# Altium project SolarArray1.PrjPCB
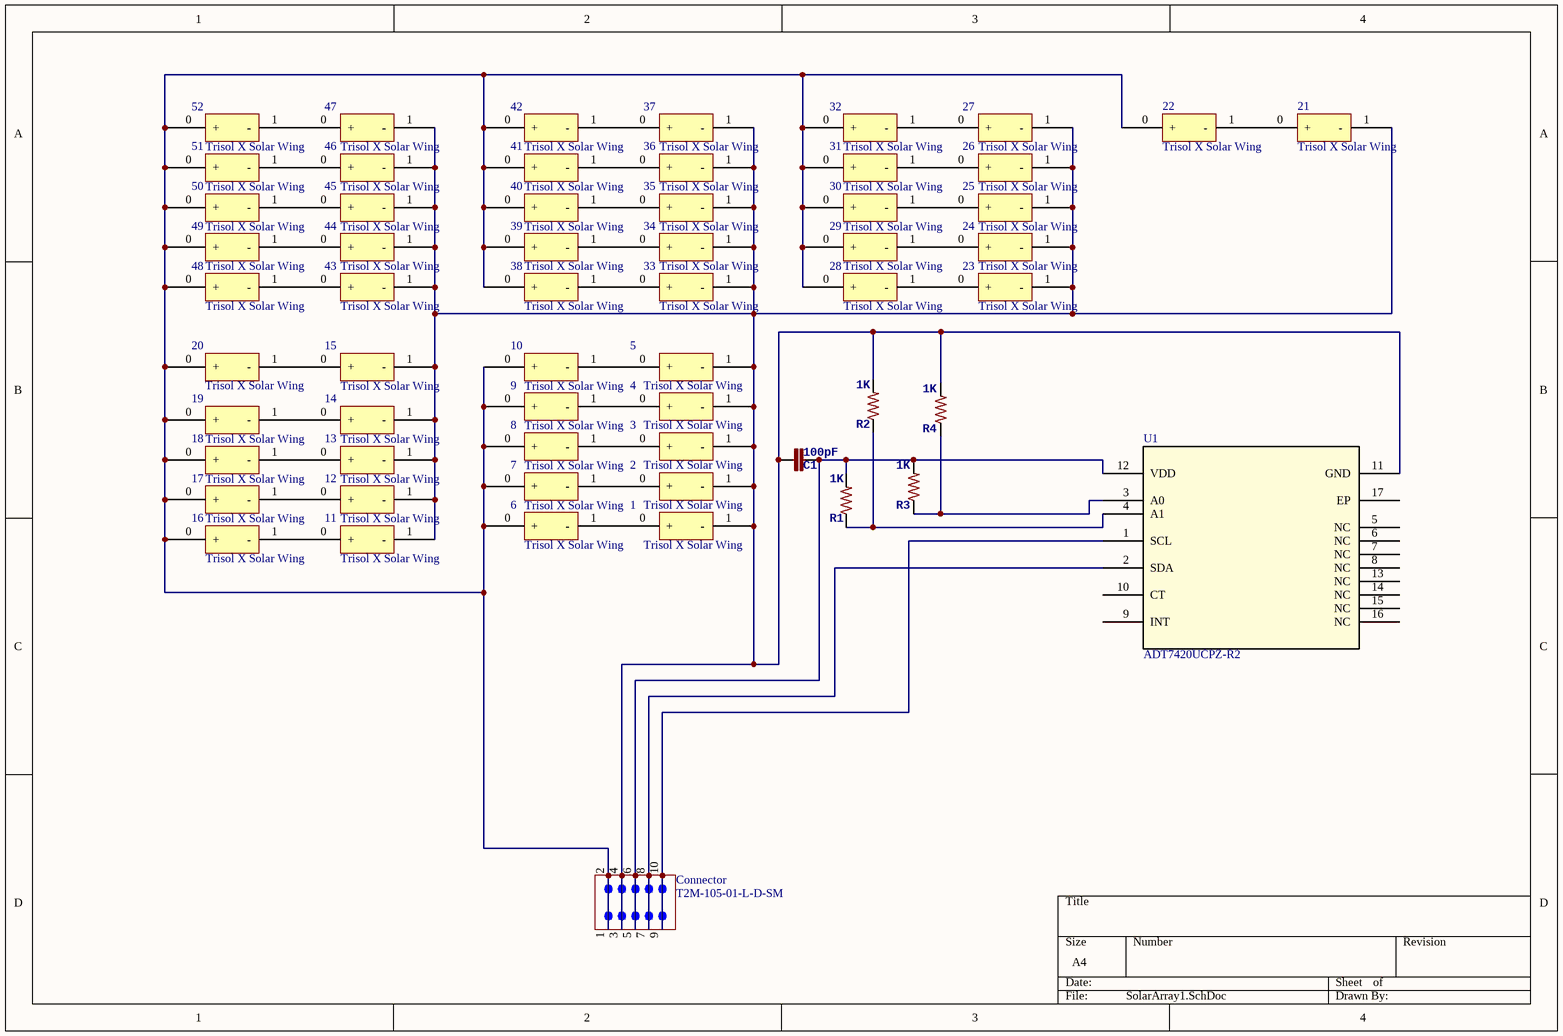
[diagram p0: SolarArray1.SchDoc]
1 sheet, 59 parts. Net scope: global (net labels, ports and power ports of the same name join across sheets).
Board file: SolarArray1.PcbDoc

## Sheet SolarArray1.SchDoc
size A4

### Parts
1  Trisol X Solar Wing  [PCBComponent_1]
2  Trisol X Solar Wing  [PCBComponent_1]
3  Trisol X Solar Wing  [PCBComponent_1]
4  Trisol X Solar Wing  [PCBComponent_1]
5  Trisol X Solar Wing  [PCBComponent_1]
6  Trisol X Solar Wing  [PCBComponent_1]
7  Trisol X Solar Wing  [PCBComponent_1]
8  Trisol X Solar Wing  [PCBComponent_1]
9  Trisol X Solar Wing  [PCBComponent_1]
10  Trisol X Solar Wing  [PCBComponent_1]
11  Trisol X Solar Wing  [PCBComponent_1]
12  Trisol X Solar Wing  [PCBComponent_1]
13  Trisol X Solar Wing  [PCBComponent_1]
14  Trisol X Solar Wing  [PCBComponent_1]
15  Trisol X Solar Wing  [PCBComponent_1]
16  Trisol X Solar Wing  [PCBComponent_1]
17  Trisol X Solar Wing  [PCBComponent_1]
18  Trisol X Solar Wing  [PCBComponent_1]
19  Trisol X Solar Wing  [PCBComponent_1]
20  Trisol X Solar Wing  [PCBComponent_1]
21  Trisol X Solar Wing  [PCBComponent_1]
22  Trisol X Solar Wing  [PCBComponent_1]
23  Trisol X Solar Wing  [PCBComponent_1]
24  Trisol X Solar Wing  [PCBComponent_1]
25  Trisol X Solar Wing  [PCBComponent_1]
26  Trisol X Solar Wing  [PCBComponent_1]
27  Trisol X Solar Wing  [PCBComponent_1]
28  Trisol X Solar Wing  [PCBComponent_1]
29  Trisol X Solar Wing  [PCBComponent_1]
30  Trisol X Solar Wing  [PCBComponent_1]
31  Trisol X Solar Wing  [PCBComponent_1]
32  Trisol X Solar Wing  [PCBComponent_1]
33  Trisol X Solar Wing  [PCBComponent_1]
34  Trisol X Solar Wing  [PCBComponent_1]
35  Trisol X Solar Wing  [PCBComponent_1]
36  Trisol X Solar Wing  [PCBComponent_1]
37  Trisol X Solar Wing  [PCBComponent_1]
38  Trisol X Solar Wing  [PCBComponent_1]
39  Trisol X Solar Wing  [PCBComponent_1]
40  Trisol X Solar Wing  [PCBComponent_1]
41  Trisol X Solar Wing  [PCBComponent_1]
42  Trisol X Solar Wing  [PCBComponent_1]
43  Trisol X Solar Wing  [PCBComponent_1]
44  Trisol X Solar Wing  [PCBComponent_1]
45  Trisol X Solar Wing  [PCBComponent_1]
46  Trisol X Solar Wing  [PCBComponent_1]
47  Trisol X Solar Wing  [PCBComponent_1]
48  Trisol X Solar Wing  [PCBComponent_1]
49  Trisol X Solar Wing  [PCBComponent_1]
50  Trisol X Solar Wing  [PCBComponent_1]
51  Trisol X Solar Wing  [PCBComponent_1]
52  Trisol X Solar Wing  [PCBComponent_1]
C1  100pF  [0805]
Connector  T2M-105-01-L-D-SM  [T2M-105-01-X-D-SM]
R1  1K  [0805]
R2  1K  [0805]
R3  1K  [0805]
R4  1K  [0805]
U1  ADT7420UCPZ-R2  [CP_16_17]

### Nets
Net1_0: 1.0(+) 6.1(-)
Net1_1: 1.1(-) 2.1(-) 3.1(-) 4.1(-) 5.1(-) 11.1(-) 12.1(-) 13.1(-) 14.1(-) 15.1(-) 21.1(-) 23.1(-) 24.1(-) 25.1(-) 26.1(-) 27.1(-) 33.1(-) 34.1(-) 35.1(-) 36.1(-) 37.1(-) 43.1(-) 44.1(-) 45.1(-) 46.1(-) 47.1(-) C1.1 Connector.3(PINLENGTH=20) Connector.4(PINLENGTH=20) R2.2 R4.2 U1.11(GND)
Net2_0: 2.0(+) 7.1(-)
Net3_0: 3.0(+) 8.1(-)
Net4_0: 4.0(+) 9.1(-)
Net5_0: 5.0(+) 10.1(-)
Net6_0: 6.0(+) 7.0(+) 8.0(+) 9.0(+) 10.0(+) 16.0(+) 17.0(+) 18.0(+) 19.0(+) 20.0(+) 22.0(+) 28.0(+) 29.0(+) 30.0(+) 31.0(+) 32.0(+) 38.0(+) 39.0(+) 40.0(+) 41.0(+) 42.0(+) 48.0(+) 49.0(+) 50.0(+) 51.0(+) 52.0(+) Connector.1(PINLENGTH=20) Connector.2(PINLENGTH=20)
Net11_0: 11.0(+) 16.1(-)
Net12_0: 12.0(+) 17.1(-)
Net13_0: 13.0(+) 18.1(-)
Net14_0: 14.0(+) 19.1(-)
Net15_0: 15.0(+) 20.1(-)
Net21_0: 21.0(+) 22.1(-)
Net23_0: 23.0(+) 28.1(-)
Net24_0: 24.0(+) 29.1(-)
Net25_0: 25.0(+) 30.1(-)
Net26_0: 26.0(+) 31.1(-)
Net27_0: 27.0(+) 32.1(-)
Net33_0: 33.0(+) 38.1(-)
Net34_0: 34.0(+) 39.1(-)
Net35_0: 35.0(+) 40.1(-)
Net36_0: 36.0(+) 41.1(-)
Net37_0: 37.0(+) 42.1(-)
Net43_0: 43.0(+) 48.1(-)
Net44_0: 44.0(+) 49.1(-)
Net45_0: 45.0(+) 50.1(-)
Net46_0: 46.0(+) 51.1(-)
Net47_0: 47.0(+) 52.1(-)
NetC1_2: C1.2 Connector.5(PINLENGTH=20) Connector.6(PINLENGTH=20) R1.2 R3.2 U1.12(VDD)
NetConnector_7: Connector.7(PINLENGTH=20) Connector.8(PINLENGTH=20) U1.2(SDA)
NetConnector_9: Connector.9(PINLENGTH=20) Connector.10(PINLENGTH=20) U1.1(SCL)
NetR1_1: R1.1 R2.1 U1.4(A1)
NetR3_1: R3.1 R4.1 U1.3(A0)

Not connected (* = marked no-connect by the designer): U1 5(NC) 6(NC) 7(NC) 8(NC) 9(INT) 10(CT) 13(NC) 14(NC) 15(NC) 16(NC) 17(EP)

### Library data of the parts
C1 = CAP0805_1nF: Tolerance: ±10%; Voltage - Rated: 10V; Temperature Coefficient: X7R; Value: 1 nF; RoHS: RoHS Compliant; Category: Capacitors; Packaging: Tape & Reel (TR); Mounting Type: Surface Mount, MLCC; Operating Temperature: -55°C ~ 125°C; Applications: General Purpose; Ratings: -; Package / Case: 0805 (2012 Metric); Size / Dimension: 0.079" L x 0.049" W (2.00mm x 1.25mm); Height - Seated (Max): -; Thickness (Max): 0.039" (1.00mm); Lead Spacing: -; Features: -; Lead Style: -; ComponentLink1URL: http://www.kemet.com/docfinder?Partnumber=C0805C105K8RACTU; ComponentLink1Description: http://www.kemet.com/docfinder?Partnumber=C0805C105K8RACTU; Supplier 1: Digi-Key; Supplier Part Number 1: 445-1330-1-ND
Connector = T2M-105-01-X-D-SM
R1-R4 = RESISTOR0805-RES_1K: Manufacturer: TE Connectivity; Manufacturer Part Number: 1625856-2; Tolerance: ±10%; Power (Watts): 0.125W, 1/8W; Temperature Coefficient: ±100ppm/°C; RoHS: RoHS Compliant; Category: Resistors; Packaging: Cut Tape (CT); Resistance (Ohms): 1K; Composition: Thick Film; Features: -; Operating Temperature: -55°C ~ 125°C; Package / Case: 0805 (2012 Metric); Supplier Device Package: 0805; Size / Dimension: 0.079" L x 0.047" W (2.00mm x 1.20mm); Height: 0.020" (0.50mm); Number of Terminations: 2; ComponentLink1URL: http://www.te.com/commerce/DocumentDelivery/DDEController?Action=srchrtrv&DocNm=1625856&DocType=Customer+Drawing&DocLang=English; ComponentLink1Description: http://www.te.com/commerce/DocumentDelivery/DDEController?Action=srchrtrv&DocNm=1625856&DocType=Customer+Drawing&DocLang=English; Supplier 1: Digi-Key; Supplier Part Number 1: P1.00KCCT-ND; Supplier 2: Newark; Supplier Part Number 2: 38K0327
U1 = ADT7420UCPZ-R2: Imported; Vendor: Analog Devices Inc; Manufacturer_Part_Number: ADT7420UCPZ-R2; Value: Value; Type: Type; RefDes: RefDes